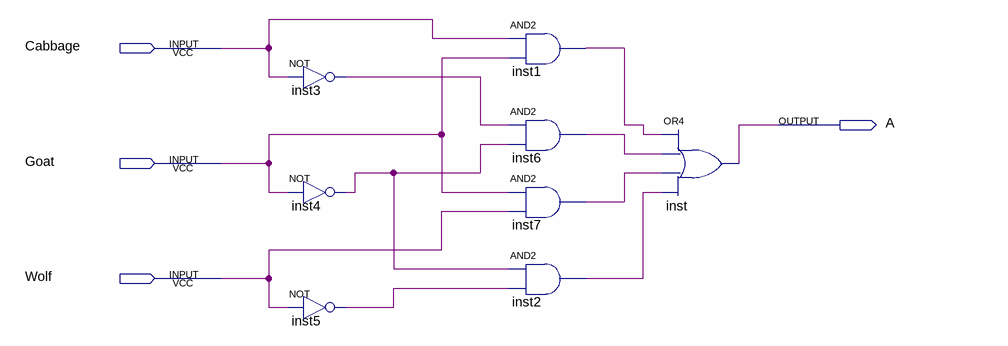
[diagram p0: schematic sheet]
// Quartus schematic lab2step2.bdf as structural Verilog: 8 symbols, 4 pins
module lab2step2 (
  input  Cabbage,
  input  Goat,
  input  Wolf,
  output A
);

  wire inst1_out, inst2_out, inst3_out, inst4_out, inst5_out, inst6_out, inst7_out;

  not inst3 (inst3_out, Cabbage);
  not inst4 (inst4_out, Goat);
  not inst5 (inst5_out, Wolf);
  and inst1 (inst1_out, Cabbage, Goat);
  and inst6 (inst6_out, inst3_out, inst4_out);
  and inst7 (inst7_out, Goat, Wolf);
  and inst2 (inst2_out, inst4_out, inst5_out);
  or inst (A, inst1_out, inst6_out, inst7_out, inst2_out);
endmodule
